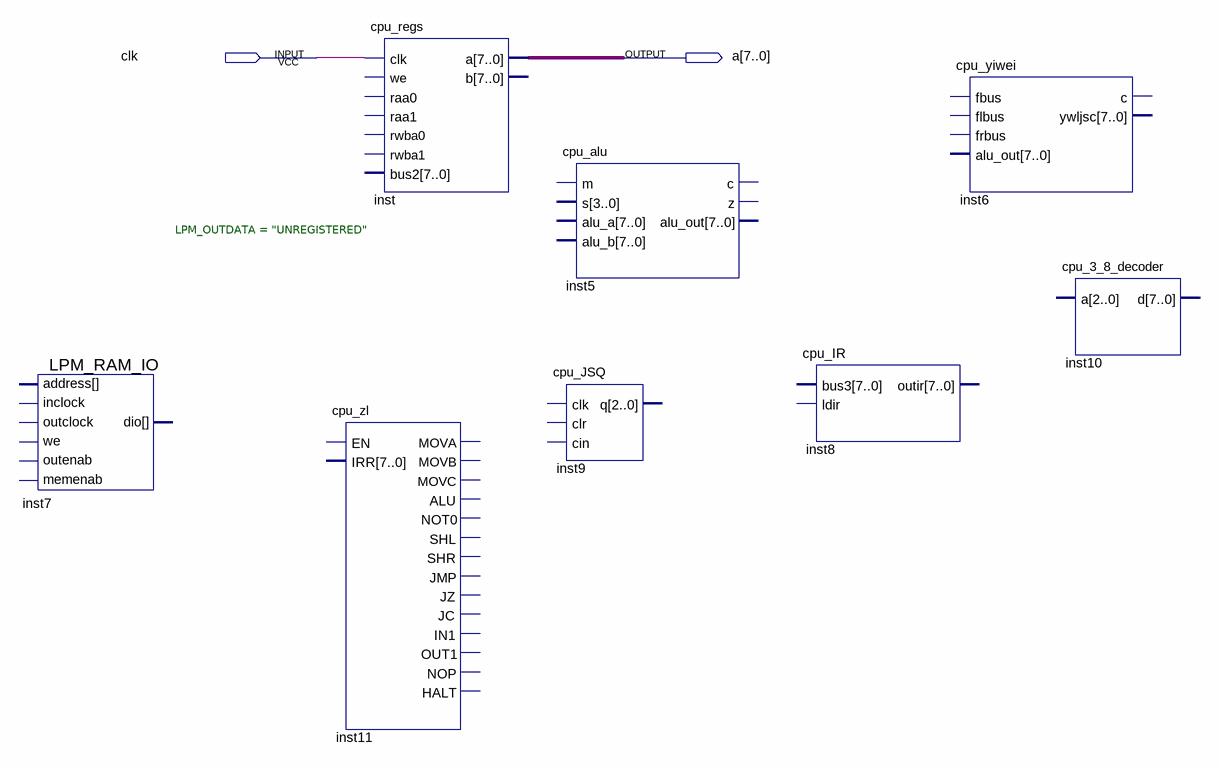
[diagram p0: schematic sheet]
// Quartus schematic cpu.bdf as structural Verilog: 8 symbols, 2 pins
module cpu (
  input  clk,
  output [7:0] a
);

  LPM_RAM_IO #(.LPM_OUTDATA("UNREGISTERED")) inst7 ();  // open: address, outclock, memenab, inclock, we, outenab, dio
  cpu_zl inst11 ();  // open: EN, IRR, MOVA, MOVB, MOVC, ALU, NOT0, SHL, SHR, JMP, JZ, JC, IN1, OUT1, NOP, HALT
  cpu_regs inst (.clk(clk), .a(a));  // open: we, raa0, raa1, rwba0, rwba1, bus2, b
  cpu_alu inst5 ();  // open: m, s, alu_a, alu_b, c, z, alu_out
  cpu_JSQ inst9 ();  // open: clk, clr, cin, q
  cpu_IR inst8 ();  // open: bus3, ldir, outir
  cpu_yiwei inst6 ();  // open: fbus, flbus, frbus, alu_out, c, ywljsc
  cpu_3_8_decoder inst10 ();  // open: a, d
endmodule
